# EAGLE design board_144 (EAGLE 5.10)

## Sheet 1 of 3
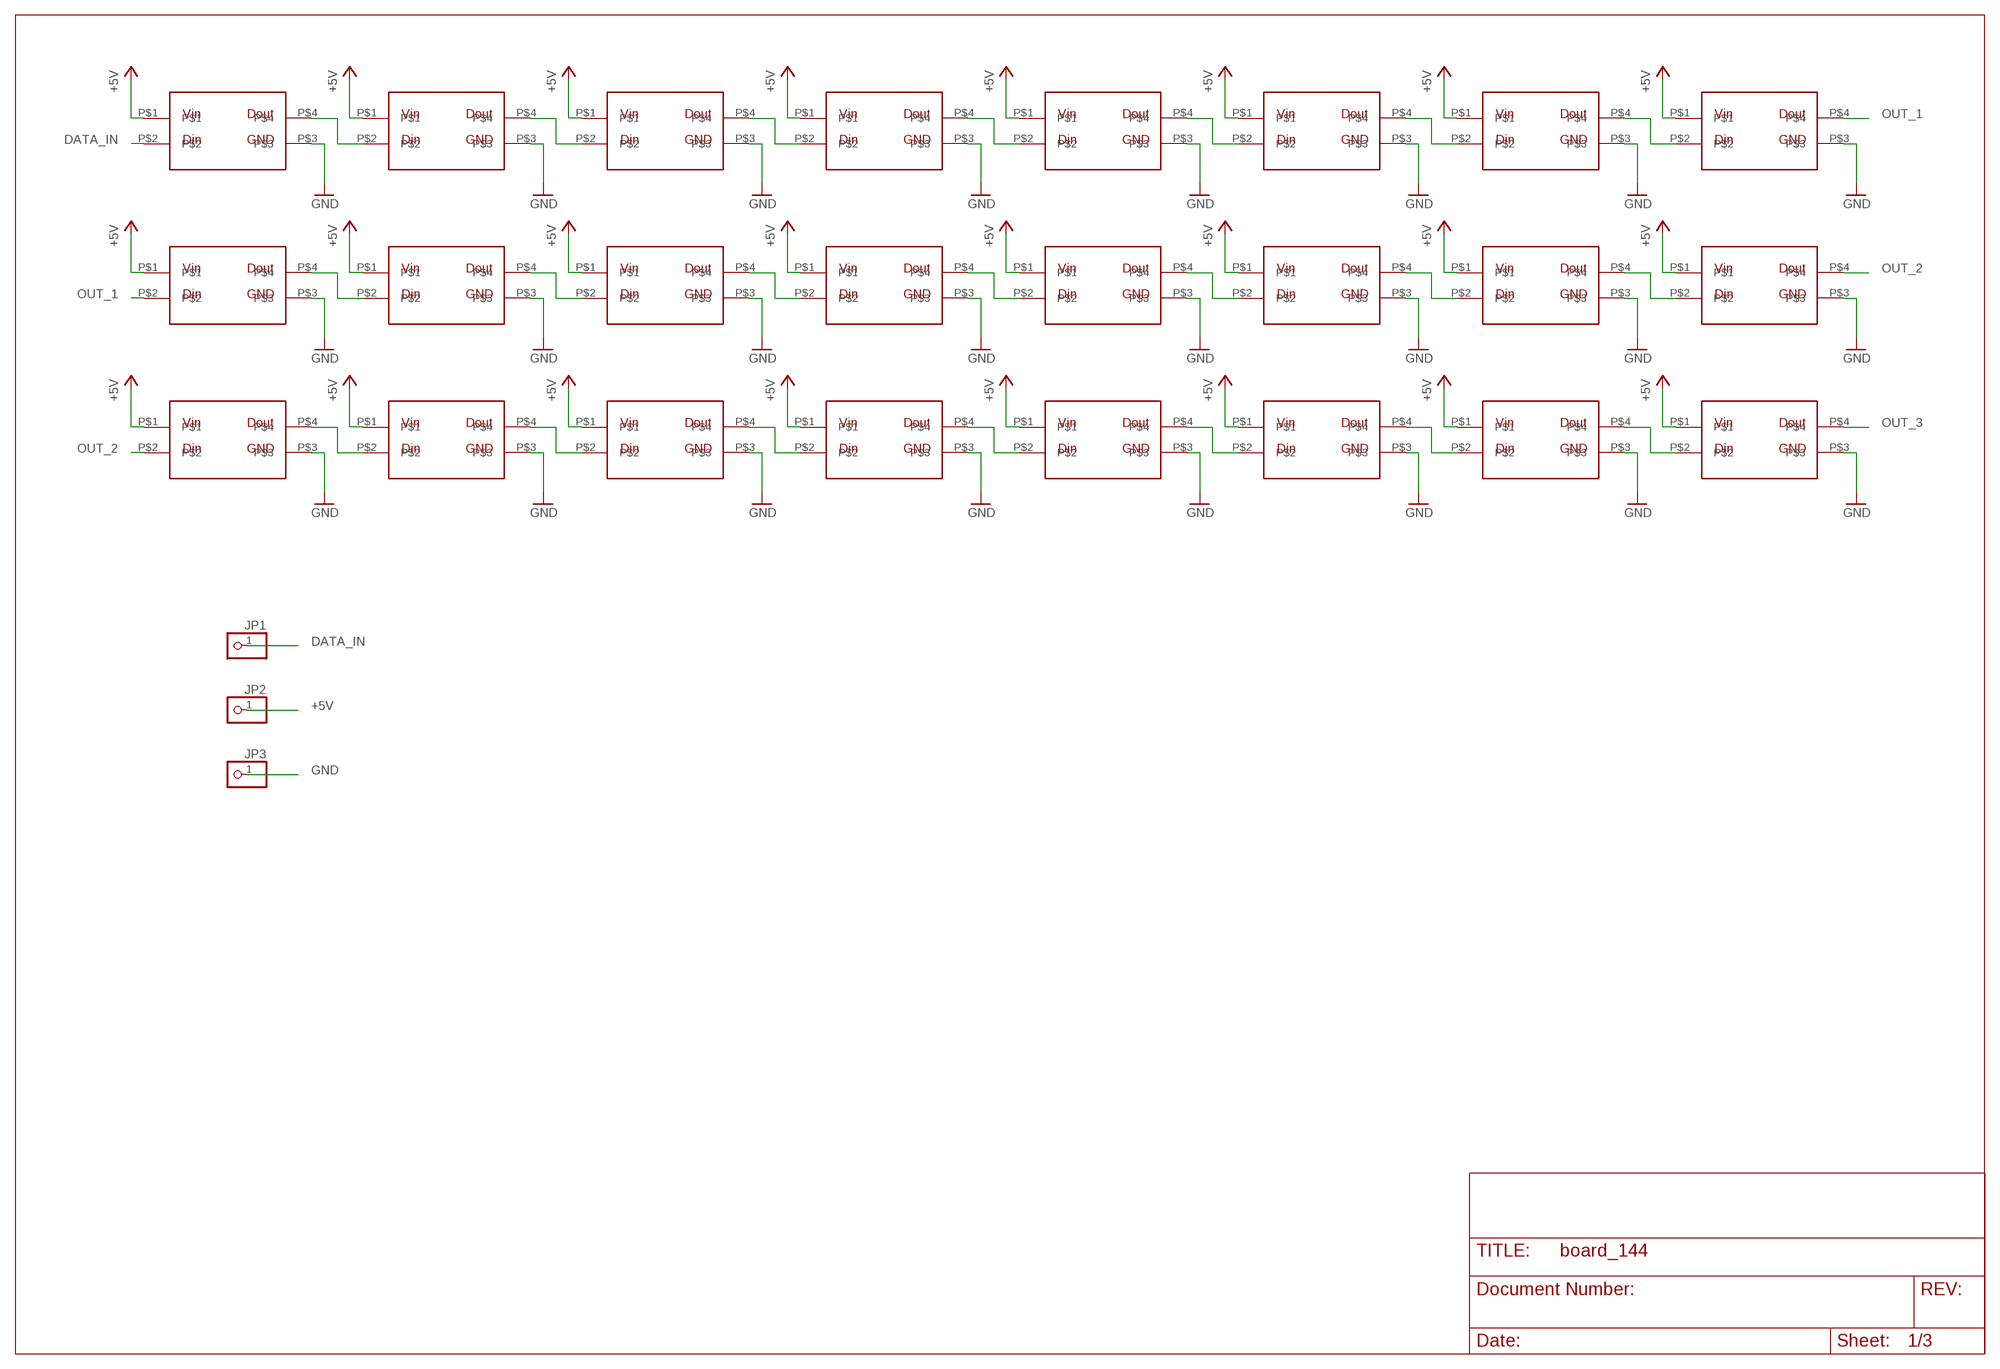
[diagram p0: schematic, sheet 1]

### Parts
JP1  PINHD-1X1  [1X01]
JP2  PINHD-1X1  [1X01]
JP3  PINHD-1X1  [1X01]
U$121  LED  [LED]
U$122  LED  [LED]
U$123  LED  [LED]
U$124  LED  [LED]
U$125  LED  [LED]
U$126  LED  [LED]
U$127  LED  [LED]
U$128  LED  [LED]
U$129  LED  [LED]
U$130  LED  [LED]
U$131  LED  [LED]
U$132  LED  [LED]
U$133  LED  [LED]
U$134  LED  [LED]
U$135  LED  [LED]
U$136  LED  [LED]
U$137  LED  [LED]
U$138  LED  [LED]
U$139  LED  [LED]
U$140  LED  [LED]
U$141  LED  [LED]
U$142  LED  [LED]
U$143  LED  [LED]
U$144  LED  [LED]

### Nets
+5V: JP2.1 U$121.P$1 U$122.P$1 U$123.P$1 U$124.P$1 U$125.P$1 U$126.P$1 U$127.P$1 U$128.P$1 U$129.P$1 U$130.P$1 U$131.P$1 U$132.P$1 U$133.P$1 U$134.P$1 U$135.P$1 U$136.P$1 U$137.P$1 U$138.P$1 U$139.P$1 U$140.P$1 U$141.P$1 U$142.P$1 U$143.P$1 U$144.P$1 ; also sheet 2,3
DATA_IN: JP1.1 U$121.P$2
GND: JP3.1 U$121.P$3 U$122.P$3 U$123.P$3 U$124.P$3 U$125.P$3 U$126.P$3 U$127.P$3 U$128.P$3 U$129.P$3 U$130.P$3 U$131.P$3 U$132.P$3 U$133.P$3 U$134.P$3 U$135.P$3 U$136.P$3 U$137.P$3 U$138.P$3 U$139.P$3 U$140.P$3 U$141.P$3 U$142.P$3 U$143.P$3 U$144.P$3 ; also sheet 2,3
N$105: U$121.P$4 U$122.P$2
N$106: U$122.P$4 U$123.P$2
N$107: U$123.P$4 U$124.P$2
N$108: U$124.P$4 U$125.P$2
N$109: U$125.P$4 U$126.P$2
N$110: U$126.P$4 U$127.P$2
N$111: U$127.P$4 U$128.P$2
N$112: U$129.P$4 U$130.P$2
N$113: U$130.P$4 U$131.P$2
N$114: U$131.P$4 U$132.P$2
N$115: U$132.P$4 U$133.P$2
N$116: U$133.P$4 U$134.P$2
N$117: U$134.P$4 U$135.P$2
N$118: U$135.P$4 U$136.P$2
N$119: U$137.P$4 U$138.P$2
N$120: U$138.P$4 U$139.P$2
N$121: U$139.P$4 U$140.P$2
N$122: U$140.P$4 U$141.P$2
N$123: U$141.P$4 U$142.P$2
N$124: U$142.P$4 U$143.P$2
N$125: U$143.P$4 U$144.P$2
OUT_1: U$128.P$4 U$129.P$2
OUT_2: U$136.P$4 U$137.P$2
OUT_3: U$144.P$4 ; also sheet 2

## Sheet 2 of 3
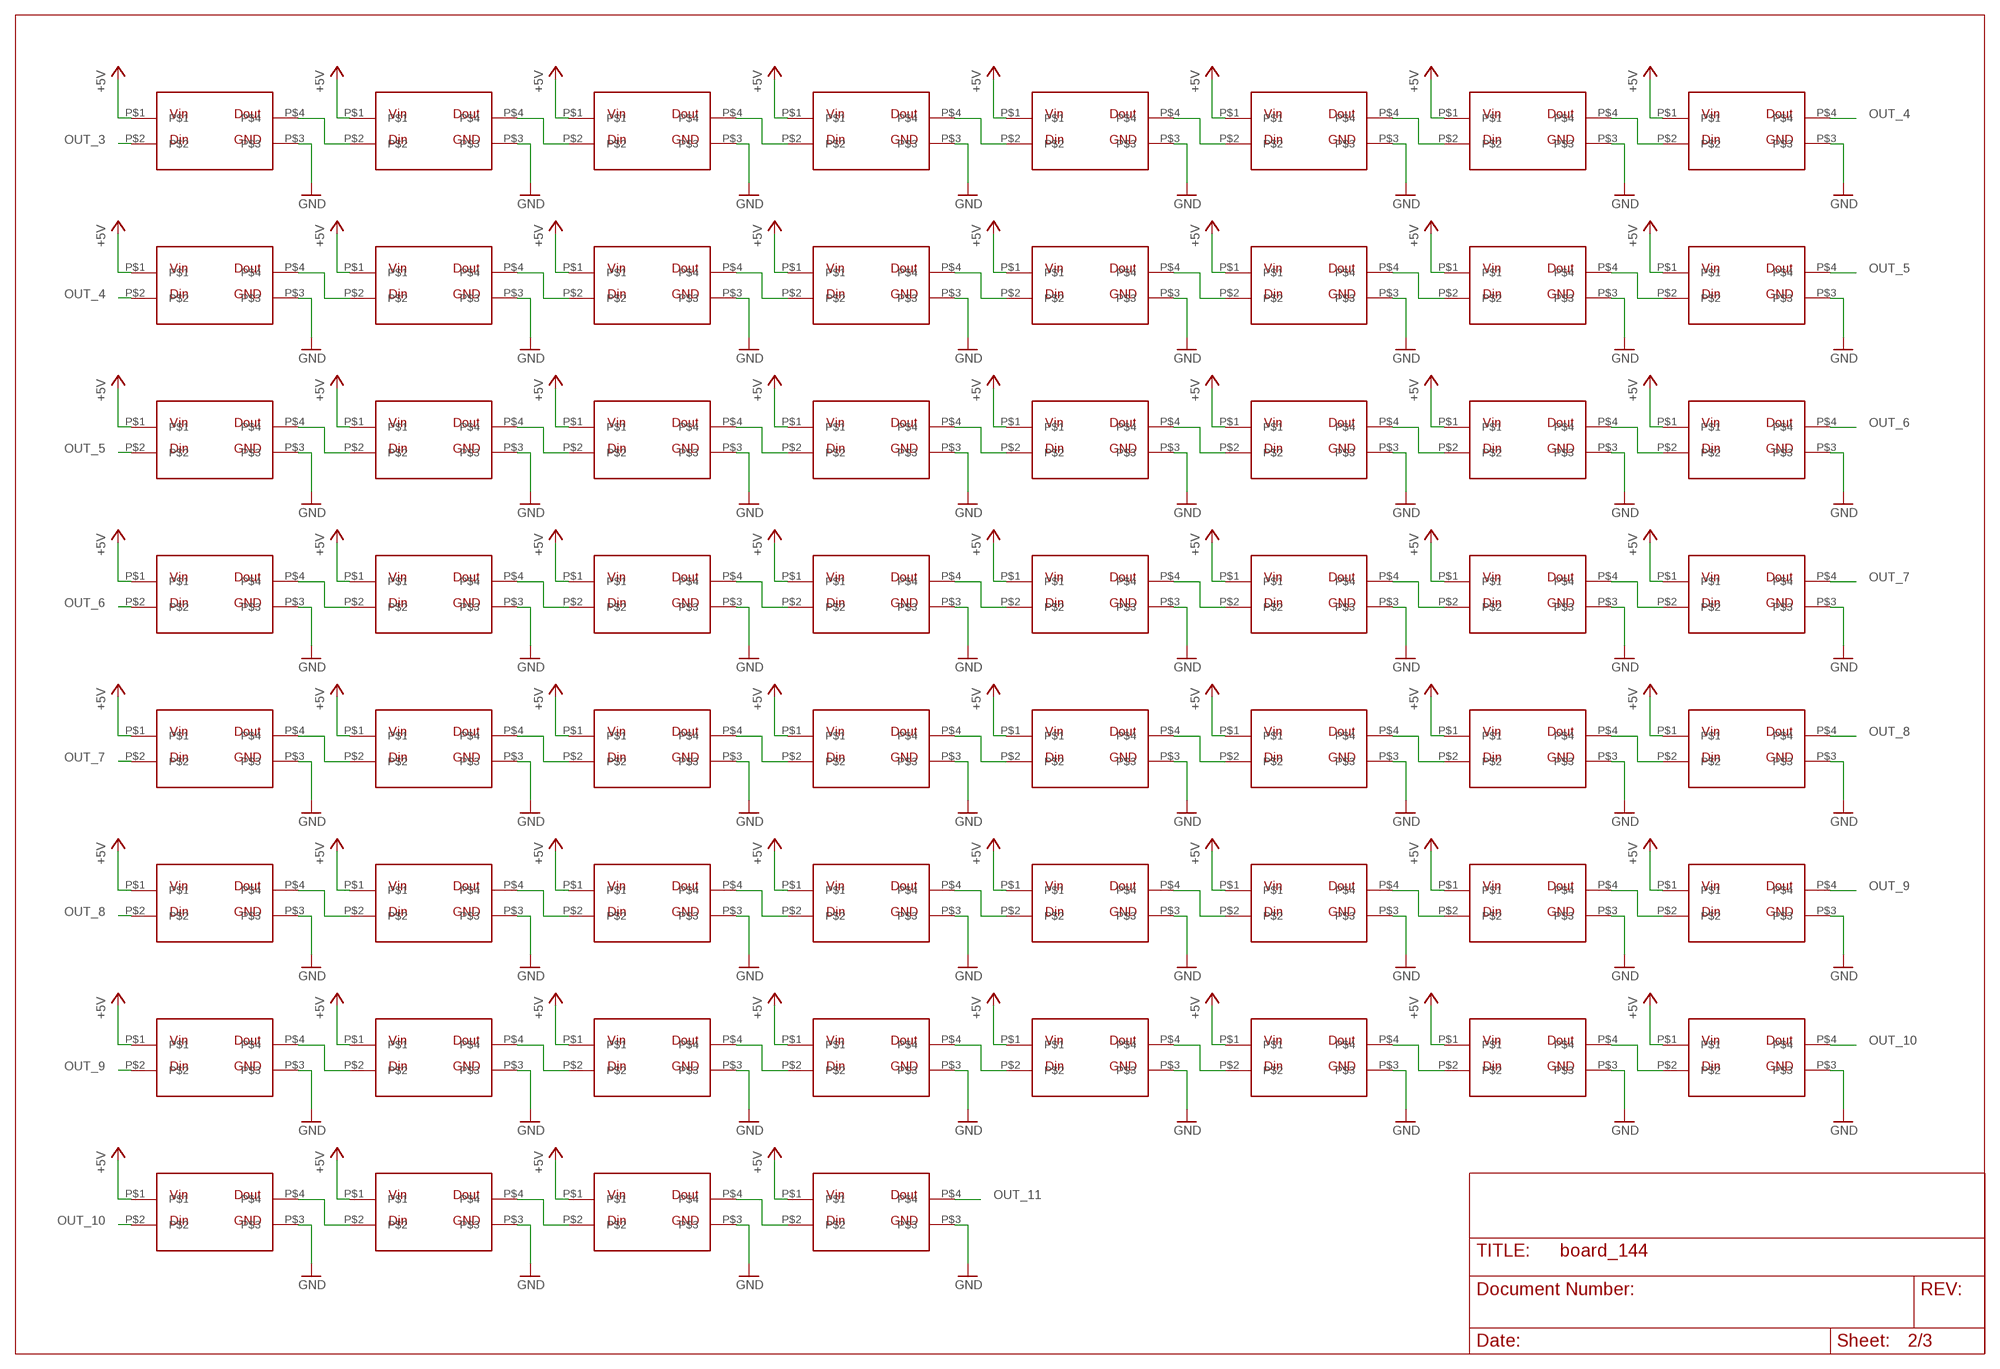
[diagram p1: schematic, sheet 2]

### Parts
U$1  LED  [LED]
U$2  LED  [LED]
U$3  LED  [LED]
U$4  LED  [LED]
U$5  LED  [LED]
U$6  LED  [LED]
U$7  LED  [LED]
U$8  LED  [LED]
U$9  LED  [LED]
U$10  LED  [LED]
U$11  LED  [LED]
U$12  LED  [LED]
U$13  LED  [LED]
U$14  LED  [LED]
U$15  LED  [LED]
U$16  LED  [LED]
U$17  LED  [LED]
U$18  LED  [LED]
U$19  LED  [LED]
U$20  LED  [LED]
U$21  LED  [LED]
U$22  LED  [LED]
U$23  LED  [LED]
U$24  LED  [LED]
U$25  LED  [LED]
U$26  LED  [LED]
U$27  LED  [LED]
U$28  LED  [LED]
U$29  LED  [LED]
U$30  LED  [LED]
U$31  LED  [LED]
U$32  LED  [LED]
U$33  LED  [LED]
U$34  LED  [LED]
U$35  LED  [LED]
U$36  LED  [LED]
U$37  LED  [LED]
U$38  LED  [LED]
U$39  LED  [LED]
U$40  LED  [LED]
U$41  LED  [LED]
U$42  LED  [LED]
U$43  LED  [LED]
U$44  LED  [LED]
U$45  LED  [LED]
U$46  LED  [LED]
U$47  LED  [LED]
U$48  LED  [LED]
U$49  LED  [LED]
U$50  LED  [LED]
U$51  LED  [LED]
U$52  LED  [LED]
U$53  LED  [LED]
U$54  LED  [LED]
U$55  LED  [LED]
U$56  LED  [LED]
U$57  LED  [LED]
U$58  LED  [LED]
U$59  LED  [LED]
U$60  LED  [LED]

### Nets
+5V: U$1.P$1 U$2.P$1 U$3.P$1 U$4.P$1 U$5.P$1 U$6.P$1 U$7.P$1 U$8.P$1 U$9.P$1 U$10.P$1 U$11.P$1 U$12.P$1 U$13.P$1 U$14.P$1 U$15.P$1 U$16.P$1 U$17.P$1 U$18.P$1 U$19.P$1 U$20.P$1 U$21.P$1 U$22.P$1 U$23.P$1 U$24.P$1 U$25.P$1 U$26.P$1 U$27.P$1 U$28.P$1 U$29.P$1 U$30.P$1 U$31.P$1 U$32.P$1 U$33.P$1 U$34.P$1 U$35.P$1 U$36.P$1 U$37.P$1 U$38.P$1 U$39.P$1 U$40.P$1 U$41.P$1 U$42.P$1 U$43.P$1 U$44.P$1 U$45.P$1 U$46.P$1 U$47.P$1 U$48.P$1 U$49.P$1 U$50.P$1 U$51.P$1 U$52.P$1 U$53.P$1 U$54.P$1 U$55.P$1 U$56.P$1 U$57.P$1 U$58.P$1 U$59.P$1 U$60.P$1 ; also sheet 1,3
GND: U$1.P$3 U$2.P$3 U$3.P$3 U$4.P$3 U$5.P$3 U$6.P$3 U$7.P$3 U$8.P$3 U$9.P$3 U$10.P$3 U$11.P$3 U$12.P$3 U$13.P$3 U$14.P$3 U$15.P$3 U$16.P$3 U$17.P$3 U$18.P$3 U$19.P$3 U$20.P$3 U$21.P$3 U$22.P$3 U$23.P$3 U$24.P$3 U$25.P$3 U$26.P$3 U$27.P$3 U$28.P$3 U$29.P$3 U$30.P$3 U$31.P$3 U$32.P$3 U$33.P$3 U$34.P$3 U$35.P$3 U$36.P$3 U$37.P$3 U$38.P$3 U$39.P$3 U$40.P$3 U$41.P$3 U$42.P$3 U$43.P$3 U$44.P$3 U$45.P$3 U$46.P$3 U$47.P$3 U$48.P$3 U$49.P$3 U$50.P$3 U$51.P$3 U$52.P$3 U$53.P$3 U$54.P$3 U$55.P$3 U$56.P$3 U$57.P$3 U$58.P$3 U$59.P$3 U$60.P$3 ; also sheet 1,3
N$1: U$1.P$4 U$3.P$2
N$2: U$1.P$2 U$2.P$4
N$3: U$3.P$4 U$4.P$2
N$4: U$4.P$4 U$5.P$2
N$5: U$5.P$4 U$6.P$2
N$6: U$6.P$4 U$7.P$2
N$7: U$7.P$4 U$8.P$2
N$8: U$9.P$4 U$10.P$2
N$9: U$10.P$4 U$11.P$2
N$10: U$11.P$4 U$12.P$2
N$11: U$12.P$4 U$13.P$2
N$12: U$13.P$4 U$14.P$2
N$13: U$14.P$4 U$15.P$2
N$14: U$15.P$4 U$16.P$2
N$15: U$17.P$4 U$18.P$2
N$16: U$18.P$4 U$19.P$2
N$17: U$19.P$4 U$20.P$2
N$18: U$20.P$4 U$21.P$2
N$19: U$21.P$4 U$22.P$2
N$20: U$22.P$4 U$23.P$2
N$21: U$23.P$4 U$24.P$2
N$22: U$25.P$4 U$26.P$2
N$23: U$26.P$4 U$27.P$2
N$24: U$27.P$4 U$28.P$2
N$25: U$28.P$4 U$29.P$2
N$26: U$29.P$4 U$30.P$2
N$27: U$30.P$4 U$31.P$2
N$28: U$31.P$4 U$32.P$2
N$29: U$33.P$4 U$34.P$2
N$30: U$34.P$4 U$35.P$2
N$31: U$35.P$4 U$36.P$2
N$32: U$36.P$4 U$37.P$2
N$33: U$37.P$4 U$38.P$2
N$34: U$38.P$4 U$39.P$2
N$35: U$39.P$4 U$40.P$2
N$36: U$41.P$4 U$42.P$2
N$37: U$42.P$4 U$43.P$2
N$38: U$43.P$4 U$44.P$2
N$39: U$44.P$4 U$45.P$2
N$40: U$45.P$4 U$46.P$2
N$41: U$46.P$4 U$47.P$2
N$42: U$47.P$4 U$48.P$2
N$43: U$49.P$4 U$50.P$2
N$44: U$50.P$4 U$51.P$2
N$45: U$51.P$4 U$52.P$2
N$46: U$52.P$4 U$53.P$2
N$47: U$53.P$4 U$54.P$2
N$48: U$54.P$4 U$55.P$2
N$49: U$55.P$4 U$56.P$2
N$51: U$57.P$4 U$58.P$2
N$52: U$58.P$4 U$59.P$2
N$53: U$59.P$4 U$60.P$2
OUT_3: U$2.P$2 ; also sheet 1
OUT_4: U$8.P$4 U$9.P$2
OUT_5: U$16.P$4 U$17.P$2
OUT_6: U$24.P$4 U$25.P$2
OUT_7: U$32.P$4 U$33.P$2
OUT_8: U$40.P$4 U$41.P$2
OUT_9: U$48.P$4 U$49.P$2
OUT_10: U$56.P$4 U$57.P$2
OUT_11: U$60.P$4 ; also sheet 3

## Sheet 3 of 3
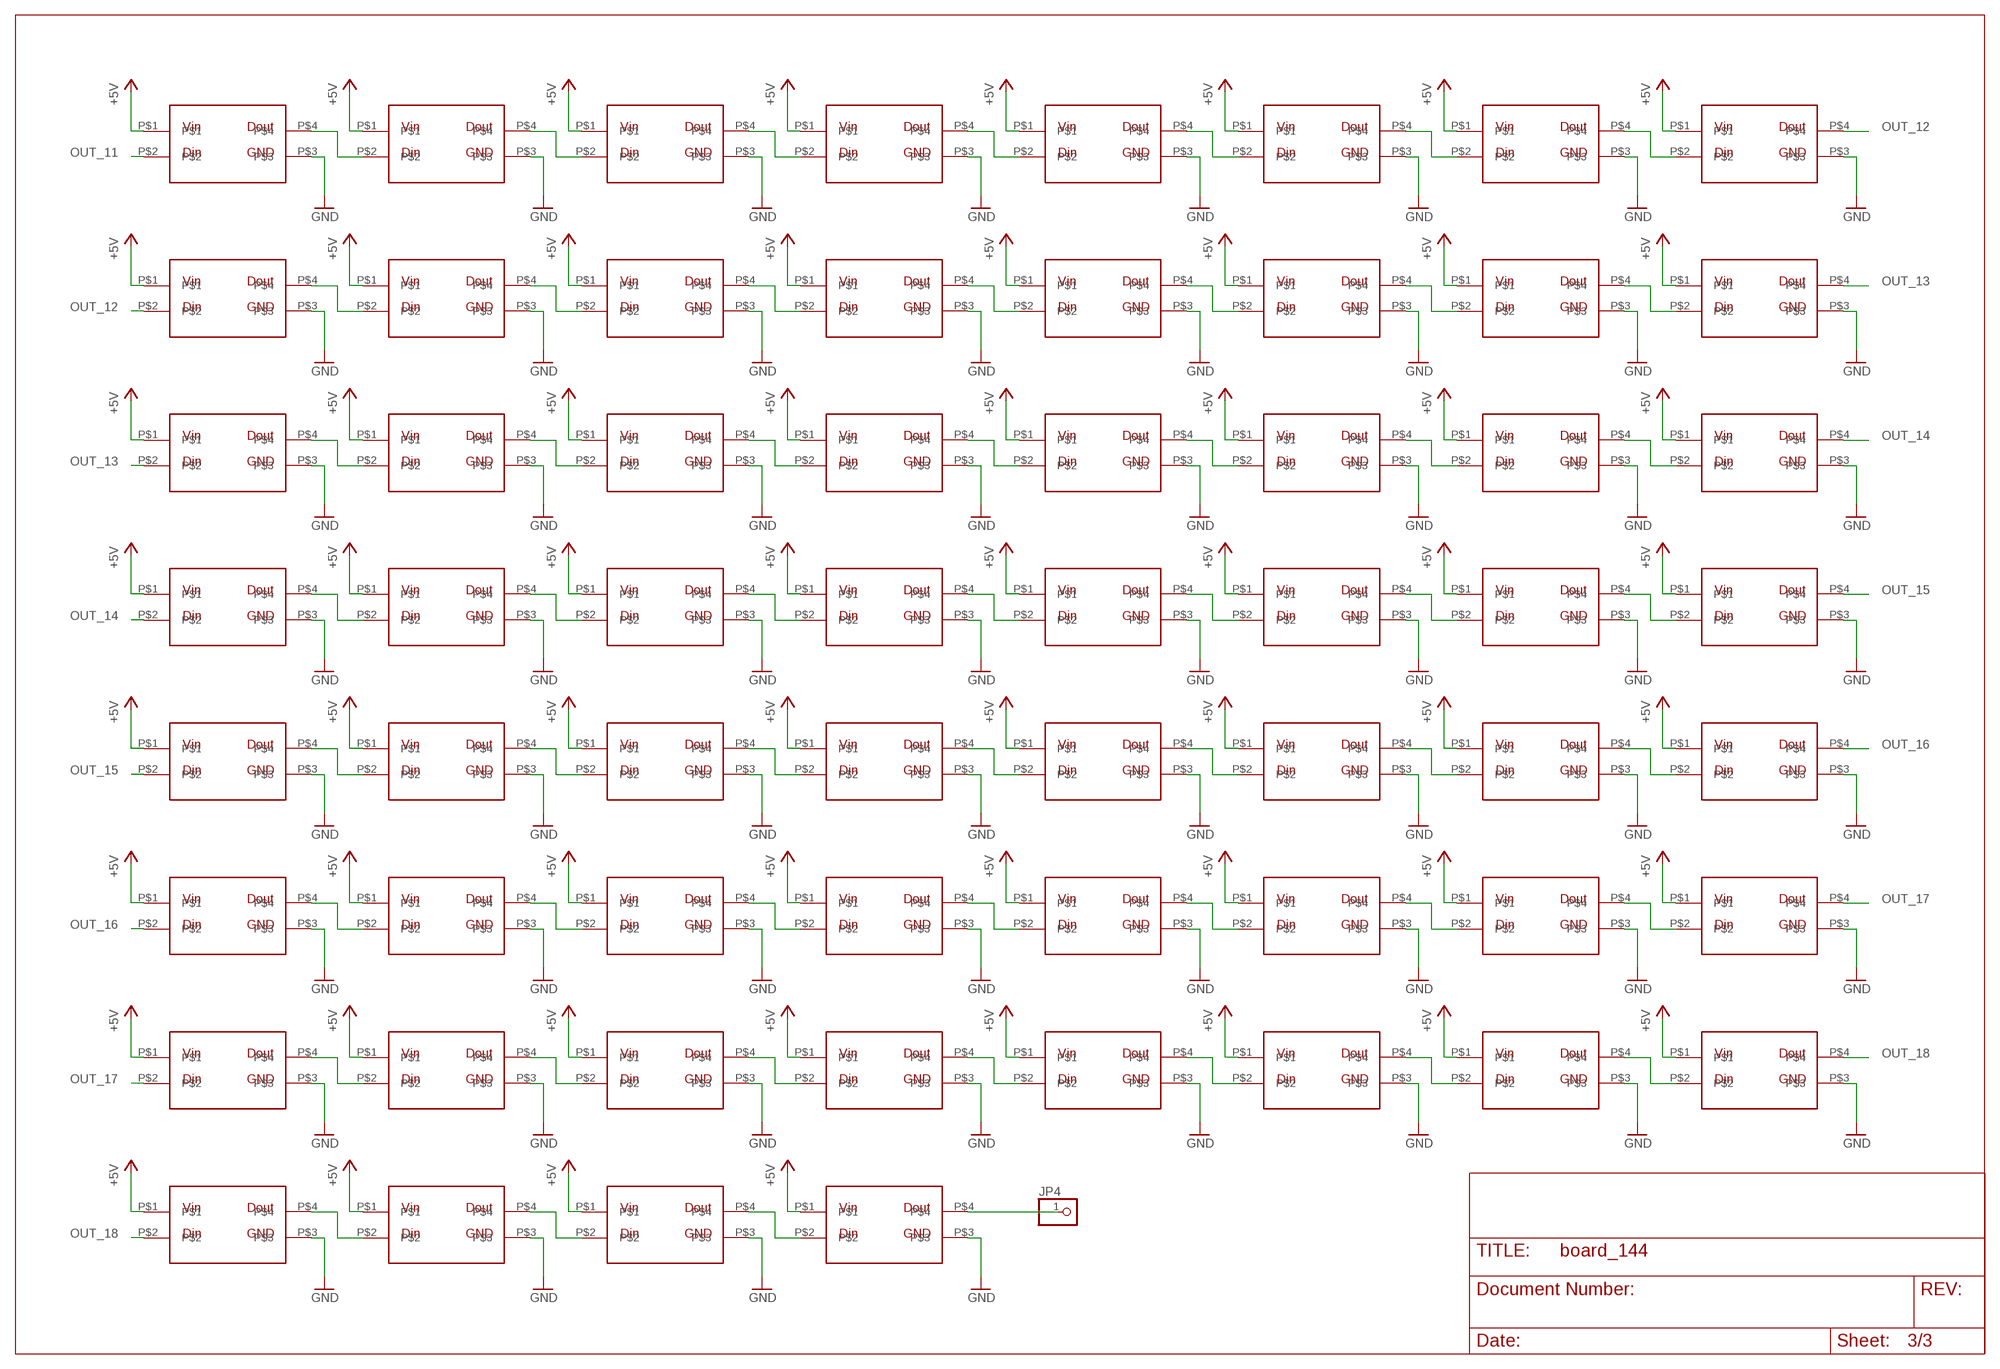
[diagram p2: schematic, sheet 3]

### Parts
JP4  PINHD-1X1  [1X01]
U$61  LED  [LED]
U$62  LED  [LED]
U$63  LED  [LED]
U$64  LED  [LED]
U$65  LED  [LED]
U$66  LED  [LED]
U$67  LED  [LED]
U$68  LED  [LED]
U$69  LED  [LED]
U$70  LED  [LED]
U$71  LED  [LED]
U$72  LED  [LED]
U$73  LED  [LED]
U$74  LED  [LED]
U$75  LED  [LED]
U$76  LED  [LED]
U$77  LED  [LED]
U$78  LED  [LED]
U$79  LED  [LED]
U$80  LED  [LED]
U$81  LED  [LED]
U$82  LED  [LED]
U$83  LED  [LED]
U$84  LED  [LED]
U$85  LED  [LED]
U$86  LED  [LED]
U$87  LED  [LED]
U$88  LED  [LED]
U$89  LED  [LED]
U$90  LED  [LED]
U$91  LED  [LED]
U$92  LED  [LED]
U$93  LED  [LED]
U$94  LED  [LED]
U$95  LED  [LED]
U$96  LED  [LED]
U$97  LED  [LED]
U$98  LED  [LED]
U$99  LED  [LED]
U$100  LED  [LED]
U$101  LED  [LED]
U$102  LED  [LED]
U$103  LED  [LED]
U$104  LED  [LED]
U$105  LED  [LED]
U$106  LED  [LED]
U$107  LED  [LED]
U$108  LED  [LED]
U$109  LED  [LED]
U$110  LED  [LED]
U$111  LED  [LED]
U$112  LED  [LED]
U$113  LED  [LED]
U$114  LED  [LED]
U$115  LED  [LED]
U$116  LED  [LED]
U$117  LED  [LED]
U$118  LED  [LED]
U$119  LED  [LED]
U$120  LED  [LED]

### Nets
+5V: U$61.P$1 U$62.P$1 U$63.P$1 U$64.P$1 U$65.P$1 U$66.P$1 U$67.P$1 U$68.P$1 U$69.P$1 U$70.P$1 U$71.P$1 U$72.P$1 U$73.P$1 U$74.P$1 U$75.P$1 U$76.P$1 U$77.P$1 U$78.P$1 U$79.P$1 U$80.P$1 U$81.P$1 U$82.P$1 U$83.P$1 U$84.P$1 U$85.P$1 U$86.P$1 U$87.P$1 U$88.P$1 U$89.P$1 U$90.P$1 U$91.P$1 U$92.P$1 U$93.P$1 U$94.P$1 U$95.P$1 U$96.P$1 U$97.P$1 U$98.P$1 U$99.P$1 U$100.P$1 U$101.P$1 U$102.P$1 U$103.P$1 U$104.P$1 U$105.P$1 U$106.P$1 U$107.P$1 U$108.P$1 U$109.P$1 U$110.P$1 U$111.P$1 U$112.P$1 U$113.P$1 U$114.P$1 U$115.P$1 U$116.P$1 U$117.P$1 U$118.P$1 U$119.P$1 U$120.P$1 ; also sheet 1,2
GND: U$61.P$3 U$62.P$3 U$63.P$3 U$64.P$3 U$65.P$3 U$66.P$3 U$67.P$3 U$68.P$3 U$69.P$3 U$70.P$3 U$71.P$3 U$72.P$3 U$73.P$3 U$74.P$3 U$75.P$3 U$76.P$3 U$77.P$3 U$78.P$3 U$79.P$3 U$80.P$3 U$81.P$3 U$82.P$3 U$83.P$3 U$84.P$3 U$85.P$3 U$86.P$3 U$87.P$3 U$88.P$3 U$89.P$3 U$90.P$3 U$91.P$3 U$92.P$3 U$93.P$3 U$94.P$3 U$95.P$3 U$96.P$3 U$97.P$3 U$98.P$3 U$99.P$3 U$100.P$3 U$101.P$3 U$102.P$3 U$103.P$3 U$104.P$3 U$105.P$3 U$106.P$3 U$107.P$3 U$108.P$3 U$109.P$3 U$110.P$3 U$111.P$3 U$112.P$3 U$113.P$3 U$114.P$3 U$115.P$3 U$116.P$3 U$117.P$3 U$118.P$3 U$119.P$3 U$120.P$3 ; also sheet 1,2
N$50: U$61.P$4 U$62.P$2
N$54: U$62.P$4 U$63.P$2
N$55: U$63.P$4 U$64.P$2
N$56: U$64.P$4 U$65.P$2
N$57: U$65.P$4 U$66.P$2
N$58: U$66.P$4 U$67.P$2
N$59: U$67.P$4 U$68.P$2
N$60: U$69.P$4 U$70.P$2
N$61: U$70.P$4 U$71.P$2
N$62: U$71.P$4 U$72.P$2
N$63: U$72.P$4 U$73.P$2
N$64: U$73.P$4 U$74.P$2
N$65: U$74.P$4 U$75.P$2
N$66: U$75.P$4 U$76.P$2
N$67: U$77.P$4 U$78.P$2
N$68: U$78.P$4 U$79.P$2
N$69: U$79.P$4 U$80.P$2
N$70: U$80.P$4 U$81.P$2
N$71: U$81.P$4 U$82.P$2
N$72: U$82.P$4 U$83.P$2
N$73: U$83.P$4 U$84.P$2
N$74: U$85.P$4 U$86.P$2
N$75: U$86.P$4 U$87.P$2
N$76: U$87.P$4 U$88.P$2
N$77: U$88.P$4 U$89.P$2
N$78: U$89.P$4 U$90.P$2
N$79: U$90.P$4 U$91.P$2
N$80: U$91.P$4 U$92.P$2
N$81: U$93.P$4 U$94.P$2
N$82: U$94.P$4 U$95.P$2
N$83: U$95.P$4 U$96.P$2
N$84: U$96.P$4 U$97.P$2
N$85: U$97.P$4 U$98.P$2
N$86: U$98.P$4 U$99.P$2
N$87: U$99.P$4 U$100.P$2
N$88: U$101.P$4 U$102.P$2
N$89: U$102.P$4 U$103.P$2
N$90: U$103.P$4 U$104.P$2
N$91: U$104.P$4 U$105.P$2
N$92: U$105.P$4 U$106.P$2
N$93: U$106.P$4 U$107.P$2
N$94: U$107.P$4 U$108.P$2
N$95: U$109.P$4 U$110.P$2
N$96: U$110.P$4 U$111.P$2
N$97: U$111.P$4 U$112.P$2
N$98: U$112.P$4 U$113.P$2
N$99: U$113.P$4 U$114.P$2
N$100: U$114.P$4 U$115.P$2
N$101: U$115.P$4 U$116.P$2
N$102: U$117.P$4 U$118.P$2
N$103: U$118.P$4 U$119.P$2
N$104: U$119.P$4 U$120.P$2
N$127: JP4.1 U$120.P$4
OUT_11: U$61.P$2 ; also sheet 2
OUT_12: U$68.P$4 U$69.P$2
OUT_13: U$76.P$4 U$77.P$2
OUT_14: U$84.P$4 U$85.P$2
OUT_15: U$92.P$4 U$93.P$2
OUT_16: U$100.P$4 U$101.P$2
OUT_17: U$108.P$4 U$109.P$2
OUT_18: U$116.P$4 U$117.P$2

## Library data of the parts
JP1-JP4 = pinhead:PINHD-1X1: PIN HEADER
U$1-U$144 = led_ringe:LED

## Board
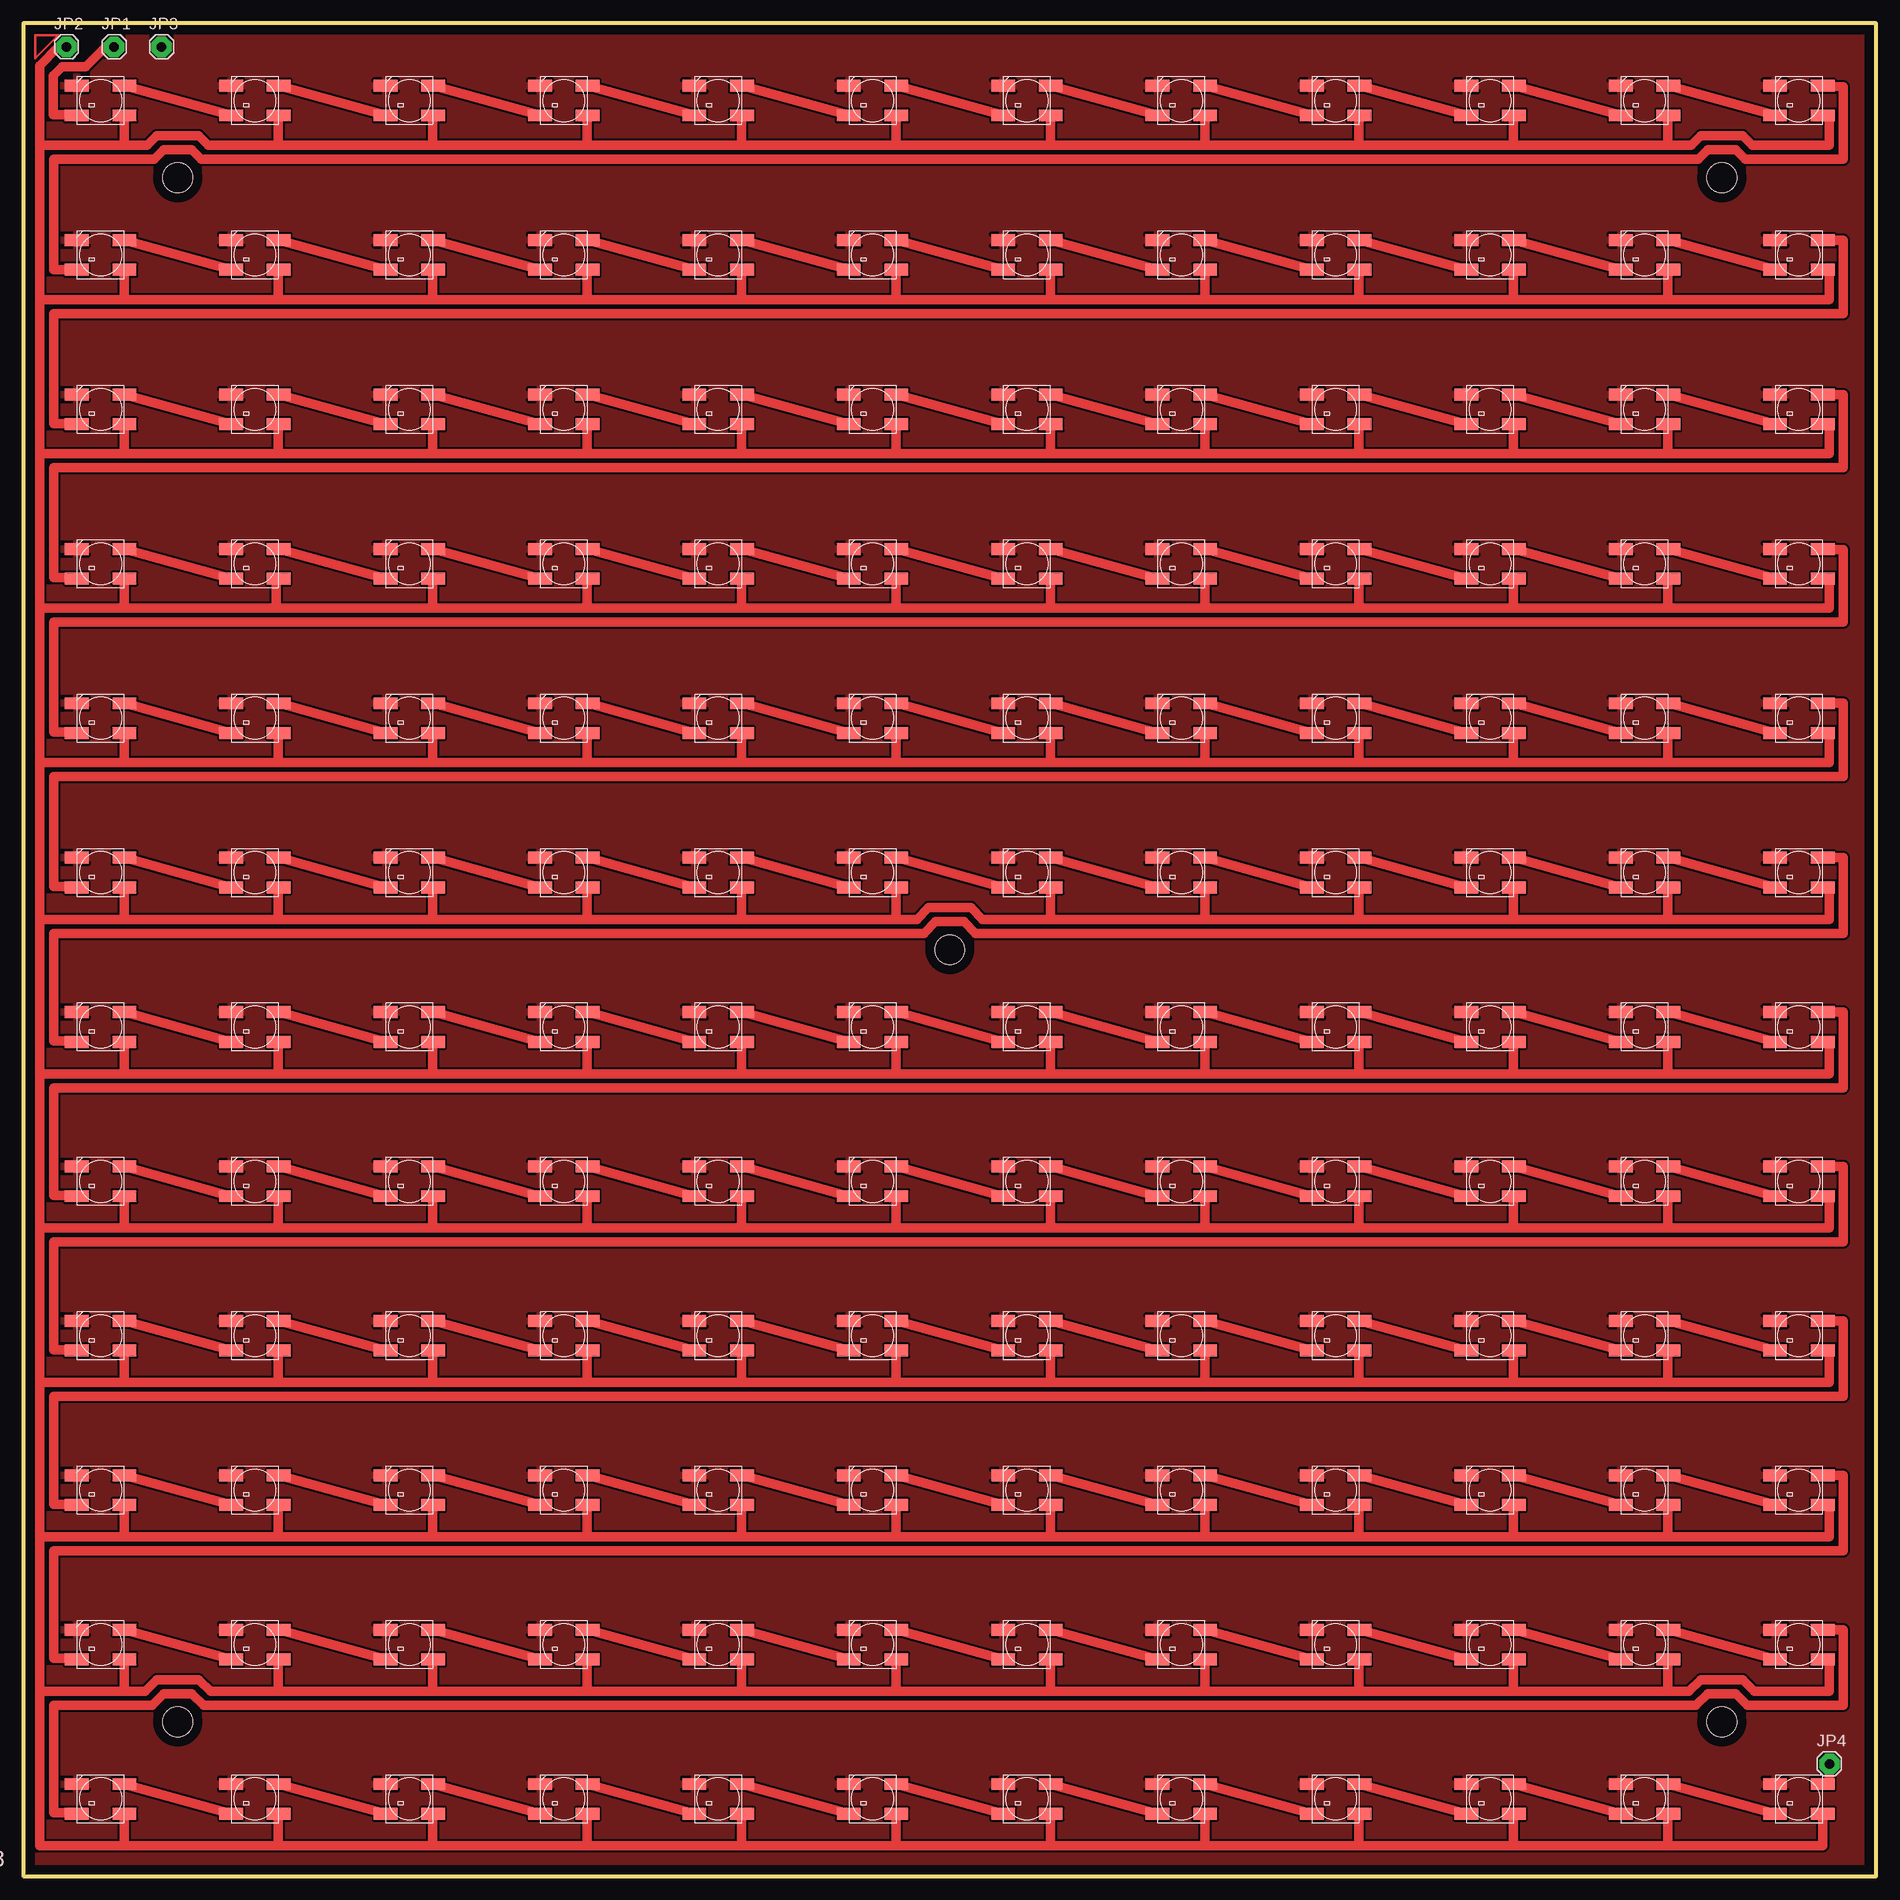
[diagram p3: board, top side]

Size 198 x 198 mm. Coordinates in mm from the lower left corner, seen from the top.
Outline: 0,0 198,0 198,198 0,198 0,0
Copper layers (1*16): Top 0.035mm / dielectric 1.5mm / Bottom 0.035mm
Design rules "default": minimum track width 10mil, minimum drill 24mil, track to track 8mil, track to pad 8mil, pad to pad 8mil, via to via 8mil, smd to smd 8mil, copper to edge 40mil, drill to drill 8mil, minimum pad ring 10mil, minimum via ring 8mil, stop-mask expansion 4mil, vias tented up to drill 0mil, thermal gap 10mil
Holes 3.2 mm at 16.5,181.5 181.5,181.5 181.5,16.5 16.5,16.5 99,99

### Footprints (pad centres in the part's own frame; a part is rotated, then mirrored left to right if it is on the bottom)
1X01 = drill 1.016 pad 2.184 octagon: 1 0,0
LED = smd 2.54 x 1.27: P$1 2.54,-1.587; P$2 -2.54,-1.587; P$3 -2.54,1.587; P$4 2.54,1.587

### Placement (x,y rotation side)
JP1  9.7,195.5 0 top
JP2  4.62,195.5 0 top
JP3  14.78,195.5 0 top
JP4  193,12 0 top
U$1  24.75,156.75 0 top
U$2  8.25,156.75 0 top
U$3  41.25,156.75 0 top
U$4  57.75,156.75 0 top
U$5  74.25,156.75 0 top
U$6  90.75,156.75 0 top
U$7  107.25,156.75 0 top
U$8  123.75,156.75 0 top
U$9  140.25,156.75 0 top
U$10  156.75,156.75 0 top
U$11  173.25,156.75 0 top
U$12  189.75,156.75 0 top
U$13  8.25,140.25 0 top
U$14  24.75,140.25 0 top
U$15  41.25,140.25 0 top
U$16  57.75,140.25 0 top
U$17  74.25,140.25 0 top
U$18  90.75,140.25 0 top
U$19  107.25,140.25 0 top
U$20  123.75,140.25 0 top
U$21  140.25,140.25 0 top
U$22  156.75,140.25 0 top
U$23  173.25,140.25 0 top
U$24  189.75,140.25 0 top
U$25  8.25,123.75 0 top
U$26  24.75,123.75 0 top
U$27  41.25,123.75 0 top
U$28  57.75,123.75 0 top
U$29  74.25,123.75 0 top
U$30  90.75,123.75 0 top
U$31  107.25,123.75 0 top
U$32  123.75,123.75 0 top
U$33  140.25,123.75 0 top
U$34  156.75,123.75 0 top
U$35  173.25,123.75 0 top
U$36  189.75,123.75 0 top
U$37  8.25,107.25 0 top
U$38  24.75,107.25 0 top
U$39  41.25,107.25 0 top
U$40  57.75,107.25 0 top
U$41  74.25,107.25 0 top
U$42  90.75,107.25 0 top
U$43  107.25,107.25 0 top
U$44  123.75,107.25 0 top
U$45  140.25,107.25 0 top
U$46  156.75,107.25 0 top
U$47  173.25,107.25 0 top
U$48  189.75,107.25 0 top
U$49  8.25,90.75 0 top
U$50  24.75,90.75 0 top
U$51  41.25,90.75 0 top
U$52  57.75,90.75 0 top
U$53  74.25,90.75 0 top
U$54  90.75,90.75 0 top
U$55  107.25,90.75 0 top
U$56  123.75,90.75 0 top
U$57  140.25,90.75 0 top
U$58  156.75,90.75 0 top
U$59  173.25,90.75 0 top
U$60  189.75,90.75 0 top
U$61  8.25,74.25 0 top
U$62  24.75,74.25 0 top
U$63  41.25,74.25 0 top
U$64  57.75,74.25 0 top
U$65  74.25,74.25 0 top
U$66  90.75,74.25 0 top
U$67  107.25,74.25 0 top
U$68  123.75,74.25 0 top
U$69  140.25,74.25 0 top
U$70  156.75,74.25 0 top
U$71  173.25,74.25 0 top
U$72  189.75,74.25 0 top
U$73  8.25,57.75 0 top
U$74  24.75,57.75 0 top
U$75  41.25,57.75 0 top
U$76  57.75,57.75 0 top
U$77  74.25,57.75 0 top
U$78  90.75,57.75 0 top
U$79  107.25,57.75 0 top
U$80  123.75,57.75 0 top
U$81  140.25,57.75 0 top
U$82  156.75,57.75 0 top
U$83  173.25,57.75 0 top
U$84  189.75,57.75 0 top
U$85  8.25,41.25 0 top
U$86  24.75,41.25 0 top
U$87  41.25,41.25 0 top
U$88  57.75,41.25 0 top
U$89  74.25,41.25 0 top
U$90  90.75,41.25 0 top
U$91  107.25,41.25 0 top
U$92  123.75,41.25 0 top
U$93  140.25,41.25 0 top
U$94  156.75,41.25 0 top
U$95  173.25,41.25 0 top
U$96  189.75,41.25 0 top
U$97  8.25,24.75 0 top
U$98  24.75,24.75 0 top
U$99  41.25,24.75 0 top
U$100  57.75,24.75 0 top
U$101  74.25,24.75 0 top
U$102  90.75,24.75 0 top
U$103  107.25,24.75 0 top
U$104  123.75,24.75 0 top
U$105  140.25,24.75 0 top
U$106  156.75,24.75 0 top
U$107  173.25,24.75 0 top
U$108  189.75,24.75 0 top
U$109  8.25,8.25 0 top
U$110  24.75,8.25 0 top
U$111  41.25,8.25 0 top
U$112  57.75,8.25 0 top
U$113  74.25,8.25 0 top
U$114  90.75,8.25 0 top
U$115  107.25,8.25 0 top
U$116  123.75,8.25 0 top
U$117  140.25,8.25 0 top
U$118  156.75,8.25 0 top
U$119  173.25,8.25 0 top
U$120  189.75,8.25 0 top
U$121  8.25,189.75 0 top
U$122  24.75,189.75 0 top
U$123  41.25,189.75 0 top
U$124  57.75,189.75 0 top
U$125  74.25,189.75 0 top
U$126  90.75,189.75 0 top
U$127  107.25,189.75 0 top
U$128  123.75,189.75 0 top
U$129  140.25,189.75 0 top
U$130  156.75,189.75 0 top
U$131  173.25,189.75 0 top
U$132  189.75,189.75 0 top
U$133  8.25,173.25 0 top
U$134  24.75,173.25 0 top
U$135  41.25,173.25 0 top
U$136  57.75,173.25 0 top
U$137  74.25,173.25 0 top
U$138  90.75,173.25 0 top
U$139  107.25,173.25 0 top
U$140  123.75,173.25 0 top
U$141  140.25,173.25 0 top
U$142  156.75,173.25 0 top
U$143  173.25,173.25 0 top
U$144  189.75,173.25 0 top

### Tracks (layer width: path | path; a pad name or v marks a point on that pad's centre or on a via)
+5V
  Top 1.016: U$132.P$1 193,188.16 193,185 184.75,185 183.75,186 179.25,186 178.25,185 175.75,185 | 76.75,185 93.25,185 | 93.25,185 109.75,185 | 109.75,185 126.25,185 | 126.25,185 142.75,185 | 142.75,185 159.25,185 | 159.25,185 175.75,185 | 60.25,185 76.75,185 | 43.75,185 60.25,185 | 27.25,185 43.75,185 | 10.75,185 13.25,185 14.25,186 18.75,186 19.75,185 27.25,185 | 1.75,185 10.75,185 | U$121.P$1 10.75,188.16 10.75,185 | U$122.P$1 27.25,188.16 27.25,185 | U$123.P$1 43.75,188.16 43.75,185 | U$124.P$1 60.25,188.16 60.25,185 | U$125.P$1 76.75,188.16 76.75,185 | U$126.P$1 93.25,188.16 93.25,185 | U$127.P$1 109.75,188.16 109.75,185 | U$128.P$1 126.25,188.16 126.25,185 | U$129.P$1 142.75,188.16 142.75,185 | U$130.P$1 159.25,188.16 159.25,185 | U$131.P$1 175.75,188.16 175.75,185 | U$144.P$1 193,171.66 193,168.5 175.75,168.5 | 1.75,168.5 10.75,168.5 | 10.75,168.5 27.25,168.5 | 27.25,168.5 43.75,168.5 | 43.75,168.5 60.25,168.5 | 60.25,168.5 76.75,168.5 | 76.75,168.5 93.25,168.5 | 93.25,168.5 109.75,168.5 | 109.75,168.5 126.25,168.5 | 126.25,168.5 142.75,168.5 | 142.75,168.5 159.25,168.5 | 159.25,168.5 175.75,168.5 | 1.75,168.5 1.75,185 | U$133.P$1 10.75,171.66 10.75,168.5 | U$134.P$1 27.25,171.66 27.25,168.5 | U$135.P$1 43.75,171.66 43.75,168.5 | U$136.P$1 60.25,171.66 60.25,168.5 | U$137.P$1 76.75,171.66 76.75,168.5 | U$138.P$1 93.25,171.66 93.25,168.5 | U$139.P$1 109.75,171.66 109.75,168.5 | U$140.P$1 126.25,171.66 126.25,168.5 | U$141.P$1 142.75,171.66 142.75,168.5 | U$142.P$1 159.25,171.66 159.25,168.5 | U$143.P$1 175.75,171.66 175.75,168.5 | U$12.P$1 193,155.16 193,152 175.75,152 | 109.75,152 126.25,152 | 126.25,152 142.75,152 | 142.75,152 159.25,152
  Top 1.016: 159.25,152 175.75,152 | 93.25,152 109.75,152 | 76.75,152 93.25,152 | 60.25,152 76.75,152 | 43.75,152 60.25,152 | 27.25,152 43.75,152 | 10.75,152 27.25,152 | 1.75,152 10.75,152 | U$2.P$1 10.75,155.16 10.75,152 | U$1.P$1 27.25,155.16 27.25,152 | U$3.P$1 43.75,155.16 43.75,152 | U$4.P$1 60.25,155.16 60.25,152 | U$5.P$1 76.75,155.16 76.75,152 | U$6.P$1 93.25,155.16 93.25,152 | U$7.P$1 109.75,155.16 109.75,152 | U$8.P$1 126.25,155.16 126.25,152 | U$9.P$1 142.75,155.16 142.75,152 | U$10.P$1 159.25,155.16 159.25,152 | U$11.P$1 175.75,155.16 175.75,152 | 1.75,152 1.75,168.5 | 1.75,135.5 1.75,152 | 1.75,119 1.75,135.5 | U$13.P$1 10.75,138.66 10.75,135.5 | 1.75,135.5 10.75,135.5 | U$24.P$1 193,138.66 193,135.5 175.75,135.5 | 10.75,135.5 27,135.5 | 27,135.5 43.75,135.5 | 43.75,135.5 60.25,135.5 | 60.25,135.5 76.75,135.5 | 76.75,135.5 93.25,135.5 | 93.25,135.5 109.75,135.5 | 109.75,135.5 126.25,135.5 | 126.25,135.5 142.75,135.5 | 142.75,135.5 159.25,135.5 | 159.25,135.5 175.75,135.5 | U$14.P$1 27,138.66 27,135.5 | U$15.P$1 43.75,138.66 43.75,135.5 | U$16.P$1 60.25,138.66 60.25,135.5 | U$17.P$1 76.75,138.66 76.75,135.5 | U$18.P$1 93.25,138.66 93.25,135.5 | U$19.P$1 109.75,138.66 109.75,135.5 | U$20.P$1 126.25,138.66 126.25,135.5 | U$21.P$1 142.75,138.66 142.75,135.5 | U$22.P$1 159.25,138.66 159.25,135.5 | U$23.P$1 175.75,138.66 175.75,135.5 | 1.75,119 10.75,119 | 10.75,119 27.25,119 | 27.25,119 43.75,119 | 43.75,119 60.25,119 | 60.25,119 76.75,119 | 76.75,119 93.25,119 | 93.25,119 109.75,119 | 109.75,119 126.25,119 | 126.25,119 142.75,119 | 142.75,119 159.25,119 | 159.25,119 175.75,119 | 1.75,19.75 1.75,3.25 10.75,3.25 | 1.75,19.75 1.75,36.25 | 1.75,85.75 1.75,102.25
  Top 1.016: 1.75,102.25 1.75,119 | U$25.P$1 10.75,122.16 10.75,119 | U$26.P$1 27.25,122.16 27.25,119 | U$27.P$1 43.75,122.16 43.75,119 | U$28.P$1 60.25,122.16 60.25,119 | U$29.P$1 76.75,122.16 76.75,119 | U$30.P$1 93.25,122.16 93.25,119 | U$31.P$1 109.75,122.16 109.75,119 | U$32.P$1 126.25,122.16 126.25,119 | U$33.P$1 142.75,122.16 142.75,119 | U$34.P$1 159.25,122.16 159.25,119 | U$35.P$1 175.75,122.16 175.75,119 | 175.75,119 193,119 193,121.75 192.75,122.25 192.29,122.25 U$36.P$1 | 10.79,102.25 U$37.P$1 | 1.75,102.25 10.79,102.25 | 10.79,102.25 27.25,102.25 | 27.25,102.25 43.75,102.25 | 43.75,102.25 60.25,102.25 | 60.25,102.25 76.75,102.25 | 76.75,102.25 93.25,102.25 | 93.25,102.25 95.5,102.25 96.75,103.5 101.25,103.5 102.5,102.25 109.75,102.25 | 109.75,102.25 126.25,102.25 | 126.25,102.25 142.75,102.25 | 142.75,102.25 159.25,102.25 | 159.25,102.25 175.75,102.25 | 175.75,102.25 193,102.25 193,105.66 U$48.P$1 | U$49.P$1 10.75,89.16 10.75,85.75 | 1.75,85.75 10.75,85.75 | 10.75,85.75 27.25,85.75 | 27.25,85.75 43.75,85.75 | 43.75,85.75 60.25,85.75 | 60.25,85.75 76.75,85.75 | 76.75,85.75 93.25,85.75 | 93.25,85.75 109.75,85.75 | 109.75,85.75 126.25,85.75 | 126.25,85.75 142.75,85.75 | 142.75,85.75 159.25,85.75 | 159.25,85.75 175.75,85.75 | 175.75,85.75 193,85.75 193,89.25 192.29,89.25 U$60.P$1 | U$61.P$1 10.75,72.66 10.75,69.25 | 1.75,69.25 10.75,69.25 | 1.75,69.25 1.75,85.75 | 10.75,69.25 27.25,69.25 | 27.25,69.25 43.75,69.25 | 43.75,69.25 60.25,69.25 | 60.25,69.25 76.75,69.25 | 76.75,69.25 93.25,69.25 | 93.25,69.25 109.75,69.25 | 109.75,69.25 126.25,69.25 | 126.25,69.25 142.75,69.25 | 142.75,69.25 159.25,69.25 | 159.25,69.25 175.75,69.25 | 175.75,69.25 193,69.25 193,72.5 192.29,72.5 U$72.P$1
  Top 1.016: U$73.P$1 10.75,56.16 10.75,52.75 | 1.75,52.75 10.75,52.75 | 1.75,52.75 1.75,69.25 | 10.75,52.75 27.25,52.75 | 27.25,52.75 43.75,52.75 | 43.75,52.75 60.25,52.75 | 60.25,52.75 76.75,52.75 | 76.75,52.75 93.25,52.75 | 93.25,52.75 109.75,52.75 | 109.75,52.75 126.25,52.75 | 126.25,52.75 142.75,52.75 | 142.75,52.75 159.25,52.75 | 159.25,52.75 175.75,52.75 | 175.75,52.75 193,52.75 193,56.25 192.29,56.25 U$84.P$1 | U$85.P$1 10.75,39.66 10.75,36.25 | 1.75,36.25 10.75,36.25 | 1.75,36.25 1.75,52.75 | 10.75,36.25 27.25,36.25 | 27.25,36.25 43.75,36.25 | 43.75,36.25 60.25,36.25 | 60.25,36.25 76.75,36.25 | 76.75,36.25 93.25,36.25 | 93.25,36.25 109.75,36.25 | 109.75,36.25 126.25,36.25 | 126.25,36.25 142.75,36.25 | 142.75,36.25 159.25,36.25 | 159.25,36.25 175.75,36.25 | 175.75,36.25 193,36.25 193,39.75 192.29,39.75 U$96.P$1 | 1.75,19.75 10.75,19.75 | U$97.P$1 10.75,23.16 10.75,19.75 | 10.75,19.75 13,19.75 14.25,21 18.75,21 20,19.75 27.25,19.75 | 27.25,19.75 43.75,19.75 | 43.75,19.75 60.25,19.75 | 60.25,19.75 76.75,19.75 | 76.75,19.75 93.25,19.75 | 93.25,19.75 109.75,19.75 | 109.75,19.75 126.25,19.75 | 126.25,19.75 142.75,19.75 | 142.75,19.75 159.25,19.75 | 159.25,19.75 175.75,19.75 | 175.75,19.75 178,19.75 179.25,21 183.75,21 185,19.75 193,19.75 193,23.25 192.29,23.25 U$108.P$1 | U$109.P$1 10.75,6.66 10.75,3.25 | 10.75,3.25 27.25,3.25 | 27.25,3.25 43.75,3.25 | 43.75,3.25 60.25,3.25 | 60.25,3.25 76.75,3.25 | 76.75,3.25 93.25,3.25 | 93.25,3.25 109.75,3.25 | 109.75,3.25 126.25,3.25 | 126.25,3.25 142.75,3.25 | 142.75,3.25 159.25,3.25 | 159.25,3.25 175.75,3.25 | 175.75,3.25 192.29,3.25 U$120.P$1 | U$119.P$1 175.75,6.66 175.75,3.25 | U$118.P$1 159.25,6.66 159.25,3.25
  Top 1.016: U$117.P$1 142.75,6.66 142.75,3.25 | U$116.P$1 126.25,6.66 126.25,3.25 | U$115.P$1 109.75,6.66 109.75,3.25 | U$114.P$1 93.25,6.66 93.25,3.25 | U$113.P$1 76.75,6.66 76.75,3.25 | U$112.P$1 60.25,6.66 60.25,3.25 | U$111.P$1 43.75,6.66 43.75,3.25 | U$110.P$1 27.25,6.66 27.25,3.25 | U$38.P$1 27.25,105.66 27.25,102.25 | U$39.P$1 43.75,105.66 43.75,102.25 | U$40.P$1 60.25,105.66 60.25,102.25 | U$41.P$1 76.75,105.66 76.75,102.25 | U$42.P$1 93.25,105.66 93.25,102.25 | U$43.P$1 109.75,105.66 109.75,102.25 | U$44.P$1 126.25,105.66 126.25,102.25 | U$45.P$1 142.75,105.66 142.75,102.25 | U$46.P$1 159.25,105.66 159.25,102.25 | U$47.P$1 175.75,105.66 175.75,102.25 | U$50.P$1 27.25,89.16 27.25,85.75 | U$51.P$1 43.75,89.16 43.75,85.75 | U$52.P$1 60.25,89.16 60.25,85.75 | U$53.P$1 76.75,89.16 76.75,85.75 | U$54.P$1 93.25,89.16 93.25,85.75 | U$55.P$1 109.75,89.16 109.75,85.75 | U$56.P$1 126.25,89.16 126.25,85.75 | U$57.P$1 142.75,89.16 142.75,85.75 | U$58.P$1 159.25,89.16 159.25,85.75 | U$59.P$1 175.75,89.16 175.75,85.75 | U$71.P$1 175.75,72.66 175.75,69.25 | U$70.P$1 159.25,72.66 159.25,69.25 | U$69.P$1 142.75,72.66 142.75,69.25 | U$68.P$1 126.25,72.66 126.25,69.25 | U$67.P$1 109.75,72.66 109.75,69.25 | U$66.P$1 93.25,72.66 93.25,69.25 | U$65.P$1 76.75,72.66 76.75,69.25 | U$64.P$1 60.25,72.66 60.25,69.25 | U$63.P$1 43.75,72.66 43.75,69.25 | U$62.P$1 27.25,72.66 27.25,69.25 | U$74.P$1 27.25,56.16 27.25,52.75 | U$75.P$1 43.75,56.16 43.75,52.75 | U$76.P$1 60.25,56.16 60.25,52.75 | U$77.P$1 76.75,56.16 76.75,52.75 | U$78.P$1 93.25,56.16 93.25,52.75 | U$79.P$1 109.75,56.16 109.75,52.75 | U$80.P$1 126.25,56.16 126.25,52.75 | U$81.P$1 142.75,56.16 142.75,52.75
  Top 1.016: U$82.P$1 159.25,56.16 159.25,52.75 | U$83.P$1 175.75,56.16 175.75,52.75 | U$95.P$1 175.75,39.66 175.75,36.25 | U$94.P$1 159.25,39.66 159.25,36.25 | U$93.P$1 142.75,39.66 142.75,36.25 | U$92.P$1 126.25,39.66 126.25,36.25 | U$91.P$1 109.75,39.66 109.75,36.25 | U$90.P$1 93.25,39.66 93.25,36.25 | U$89.P$1 76.75,39.66 76.75,36.25 | U$88.P$1 60.25,39.66 60.25,36.25 | U$87.P$1 43.75,39.66 43.75,36.25 | U$86.P$1 27.25,39.66 27.25,36.25 | U$98.P$1 27.25,23.16 27.25,19.75 | U$99.P$1 43.75,23.16 43.75,19.75 | U$100.P$1 60.25,23.16 60.25,19.75 | U$101.P$1 76.75,23.16 76.75,19.75 | U$102.P$1 93.25,23.16 93.25,19.75 | U$103.P$1 109.75,23.16 109.75,19.75 | U$104.P$1 126.25,23.16 126.25,19.75 | U$105.P$1 142.75,23.16 142.75,19.75 | U$106.P$1 159.25,23.16 159.25,19.75 | U$107.P$1 175.75,23.16 175.75,19.75 | 1.75,185 1.75,193.5 3.75,195.5 JP2.1
DATA_IN
  Top 1.016: 5.71,188.25 U$121.P$2 | 5.71,188.25 6.25,188.25 | 5.71,188.25 3.2,188.25 3.17,188.28 3.17,192.41 4.13,193.36 6.67,193.36 8.81,195.5 JP1.1
GND
  pour Top: -1.25,-1.25 199.25,-1.25 199.25,199.5 -1.25,199.5
N$1
  Top 1.016: U$1.P$4 U$3.P$2
N$2
  Top 1.016: U$2.P$4 U$1.P$2
N$3
  Top 1.016: U$3.P$4 U$4.P$2
N$4
  Top 1.016: U$4.P$4 U$5.P$2
N$5
  Top 1.016: U$5.P$4 U$6.P$2
N$6
  Top 1.016: U$7.P$2 U$6.P$4
N$7
  Top 1.016: U$7.P$4 U$8.P$2
N$8
  Top 1.016: U$9.P$4 U$10.P$2
N$9
  Top 1.016: U$10.P$4 U$11.P$2
N$10
  Top 1.016: U$11.P$4 U$12.P$2
N$11
  Top 1.016: U$12.P$4 194.5,158.34 194.5,150.5 3.25,150.5 3.25,138.75 5.71,138.75 U$13.P$2
N$12
  Top 1.016: U$13.P$4 U$14.P$2
N$13
  Top 1.016: U$14.P$4 U$15.P$2
N$14
  Top 1.016: U$15.P$4 U$16.P$2
N$15
  Top 1.016: U$17.P$4 U$18.P$2
N$16
  Top 1.016: U$18.P$4 U$19.P$2
N$17
  Top 1.016: U$20.P$2 U$19.P$4
N$18
  Top 1.016: U$20.P$4 U$21.P$2
N$19
  Top 1.016: U$21.P$4 U$22.P$2
N$20
  Top 1.016: U$22.P$4 U$23.P$2
N$21
  Top 1.016: U$23.P$4 U$24.P$2
N$22
  Top 1.016: U$25.P$4 U$26.P$2
N$23
  Top 1.016: U$26.P$4 U$27.P$2
N$24
  Top 1.016: U$27.P$4 U$28.P$2
N$25
  Top 1.016: U$28.P$4 U$29.P$2
N$26
  Top 1.016: U$29.P$4 U$30.P$2
N$27
  Top 1.016: U$30.P$4 U$31.P$2
N$28
  Top 1.016: U$31.P$4 U$32.P$2
N$29
  Top 1.016: U$33.P$4 U$34.P$2
N$30
  Top 1.016: U$34.P$4 U$35.P$2
N$31
  Top 1.016: U$35.P$4 U$36.P$2
N$32
  Top 1.016: U$36.P$4 194.5,125.34 194.5,117.5 3.25,117.5 3.25,105.75 5.71,105.75 U$37.P$2
N$33
  Top 1.016: U$37.P$4 U$38.P$2
N$34
  Top 1.016: U$38.P$4 U$39.P$2
N$35
  Top 1.016: U$39.P$4 U$40.P$2
N$36
  Top 1.016: U$41.P$4 U$42.P$2
N$37
  Top 1.016: U$42.P$4 U$43.P$2
N$38
  Top 1.016: U$43.P$4 U$44.P$2
N$39
  Top 1.016: U$44.P$4 U$45.P$2
N$40
  Top 1.016: U$46.P$2 U$45.P$4
N$41
  Top 1.016: U$46.P$4 U$47.P$2
N$42
  Top 1.016: U$47.P$4 U$48.P$2
N$43
  Top 1.016: U$49.P$4 U$50.P$2
N$44
  Top 1.016: U$50.P$4 U$51.P$2
N$45
  Top 1.016: U$51.P$4 U$52.P$2
N$46
  Top 1.016: U$52.P$4 U$53.P$2
N$47
  Top 1.016: U$53.P$4 U$54.P$2
N$48
  Top 1.016: U$54.P$4 U$55.P$2
N$49
  Top 1.016: U$55.P$4 U$56.P$2
N$50
  Top 1.016: U$61.P$4 U$62.P$2
N$51
  Top 1.016: U$57.P$4 U$58.P$2
N$52
  Top 1.016: U$59.P$2 U$58.P$4
N$53
  Top 1.016: U$59.P$4 U$60.P$2
N$54
  Top 1.016: U$62.P$4 U$63.P$2
N$55
  Top 1.016: U$63.P$4 U$64.P$2
N$56
  Top 1.016: U$64.P$4 U$65.P$2
N$57
  Top 1.016: U$65.P$4 U$66.P$2
N$58
  Top 1.016: U$66.P$4 U$67.P$2
N$59
  Top 1.016: U$67.P$4 U$68.P$2
N$60
  Top 1.016: U$69.P$4 U$70.P$2
N$61
  Top 1.016: U$70.P$4 U$71.P$2
N$62
  Top 1.016: U$72.P$2 U$71.P$4
N$63
  Top 1.016: U$72.P$4 194.5,75.84 194.5,67.75 3.25,67.75 3.25,56.25 5.71,56.25 U$73.P$2
N$64
  Top 1.016: U$73.P$4 U$74.P$2
N$65
  Top 1.016: U$74.P$4 U$75.P$2
N$66
  Top 1.016: U$75.P$4 U$76.P$2
N$67
  Top 1.016: U$77.P$4 U$78.P$2
N$68
  Top 1.016: U$78.P$4 U$79.P$2
N$69
  Top 1.016: U$79.P$4 U$80.P$2
N$70
  Top 1.016: U$80.P$4 U$81.P$2
N$71
  Top 1.016: U$81.P$4 U$82.P$2
N$72
  Top 1.016: U$82.P$4 U$83.P$2
N$73
  Top 1.016: U$83.P$4 U$84.P$2
N$74
  Top 1.016: U$85.P$4 U$86.P$2
N$75
  Top 1.016: U$86.P$4 U$87.P$2
N$76
  Top 1.016: U$87.P$4 U$88.P$2
N$77
  Top 1.016: U$88.P$4 U$89.P$2
N$78
  Top 1.016: U$89.P$4 U$90.P$2
N$79
  Top 1.016: U$90.P$4 U$91.P$2
N$80
  Top 1.016: U$91.P$4 U$92.P$2
N$81
  Top 1.016: U$93.P$4 U$94.P$2
N$82
  Top 1.016: U$94.P$4 U$95.P$2
N$83
  Top 1.016: U$95.P$4 U$96.P$2
N$84
  Top 1.016: U$96.P$4 194.5,42.84 194.5,34.75 3.25,34.75 3.25,23.25 5.71,23.25 U$97.P$2
N$85
  Top 1.016: U$97.P$4 U$98.P$2
N$86
  Top 1.016: U$98.P$4 U$99.P$2
N$87
  Top 1.016: U$99.P$4 U$100.P$2
N$88
  Top 1.016: U$101.P$4 U$102.P$2
N$89
  Top 1.016: U$102.P$4 U$103.P$2
N$90
  Top 1.016: U$103.P$4 U$104.P$2
N$91
  Top 1.016: U$104.P$4 U$105.P$2
N$92
  Top 1.016: U$105.P$4 U$106.P$2
N$93
  Top 1.016: U$106.P$4 U$107.P$2
N$94
  Top 1.016: U$107.P$4 U$108.P$2
N$95
  Top 1.016: U$109.P$4 U$110.P$2
N$96
  Top 1.016: U$110.P$4 U$111.P$2
N$97
  Top 1.016: U$111.P$4 U$112.P$2
N$98
  Top 1.016: U$112.P$4 U$113.P$2
N$99
  Top 1.016: U$113.P$4 U$114.P$2
N$100
  Top 1.016: U$114.P$4 U$115.P$2
N$101
  Top 1.016: U$115.P$4 U$116.P$2
N$102
  Top 1.016: U$117.P$4 U$118.P$2
N$103
  Top 1.016: U$118.P$4 U$119.P$2
N$104
  Top 1.016: U$119.P$4 U$120.P$2
N$105
  Top 1.016: U$121.P$4 U$122.P$2
N$106
  Top 1.016: U$122.P$4 U$123.P$2
N$107
  Top 1.016: U$123.P$4 U$124.P$2
N$108
  Top 1.016: U$125.P$2 U$124.P$4
N$109
  Top 1.016: U$125.P$4 U$126.P$2
N$110
  Top 1.016: U$126.P$4 U$127.P$2
N$111
  Top 1.016: U$127.P$4 U$128.P$2
N$112
  Top 1.016: U$129.P$4 U$130.P$2
N$113
  Top 1.016: U$130.P$4 U$131.P$2
N$114
  Top 1.016: U$131.P$4 U$132.P$2
N$115
  Top 1.016: U$132.P$4 194.5,191.25 194.5,183.5 184,183.5 183,184.5 180,184.5 179,183.5 19,183.5 18,184.5 15,184.5 14,183.5 3.25,183.5 3.25,171.66 U$133.P$2
N$116
  Top 1.016: U$133.P$4 U$134.P$2
N$117
  Top 1.016: U$134.P$4 U$135.P$2
N$118
  Top 1.016: U$135.P$4 U$136.P$2
N$119
  Top 1.016: U$138.P$2 U$137.P$4
N$120
  Top 1.016: U$138.P$4 U$139.P$2
N$121
  Top 1.016: U$139.P$4 U$140.P$2
N$122
  Top 1.016: U$140.P$4 U$141.P$2
N$123
  Top 1.016: U$141.P$4 U$142.P$2
N$124
  Top 1.016: U$142.P$4 U$143.P$2
N$125
  Top 1.016: U$143.P$4 U$144.P$2
N$126
  Top 0.254: 1.25,194.25 1.25,196.75 3.75,196.75 1.25,194.25
N$127
  Top 1.016: JP4.1 193,10 192.84,9.84 U$120.P$4
OUT_1
  Top 1.016: U$128.P$4 U$129.P$2
OUT_2
  Top 1.016: U$136.P$4 U$137.P$2
OUT_3
  Top 1.016: U$144.P$4 194.5,174.84 194.5,167 3.25,167 3.25,155.25 5.71,155.25 U$2.P$2 5.91,155.16
OUT_4
  Top 1.016: U$8.P$4 U$9.P$2
OUT_5
  Top 1.016: U$16.P$4 U$17.P$2
OUT_6
  Top 1.016: U$24.P$4 192.38,141.75 194.5,141.75 194.5,134 3.25,134 3.25,122.25 5.71,122.25 U$25.P$2
OUT_7
  Top 1.016: U$33.P$2 U$32.P$4
OUT_8
  Top 1.016: U$40.P$4 U$41.P$2
OUT_9
  Top 1.016: U$48.P$4 194.5,108.84 194.5,100.75 101.75,100.75 100.5,102 97.5,102 96.25,100.75 3.25,100.75 3.25,89.25 5.71,89.25 U$49.P$2
OUT_10
  Top 1.016: U$56.P$4 U$57.P$2
OUT_11
  Top 1.016: U$60.P$4 194.5,92.34 194.5,84.25 3.25,84.25 3.25,72.75 5.71,72.75 U$61.P$2
OUT_12
  Top 1.016: U$68.P$4 U$69.P$2
OUT_13
  Top 1.016: U$76.P$4 U$77.P$2
OUT_14
  Top 1.016: U$84.P$4 194.5,59.34 194.5,51.25 3.25,51.25 3.25,39.75 5.71,39.75 U$85.P$2
OUT_15
  Top 1.016: U$92.P$4 U$93.P$2
OUT_16
  Top 1.016: U$100.P$4 U$101.P$2
OUT_17
  Top 1.016: U$108.P$4 194.5,26.34 194.5,18.25 184.25,18.25 183,19.5 180,19.5 178.75,18.25 19.25,18.25 18,19.5 15,19.5 13.75,18.25 3.25,18.25 3.25,6.75 5.71,6.75 U$109.P$2
OUT_18
  Top 1.016: U$116.P$4 U$117.P$2

### Text on the board
tPlace: 198 x 198